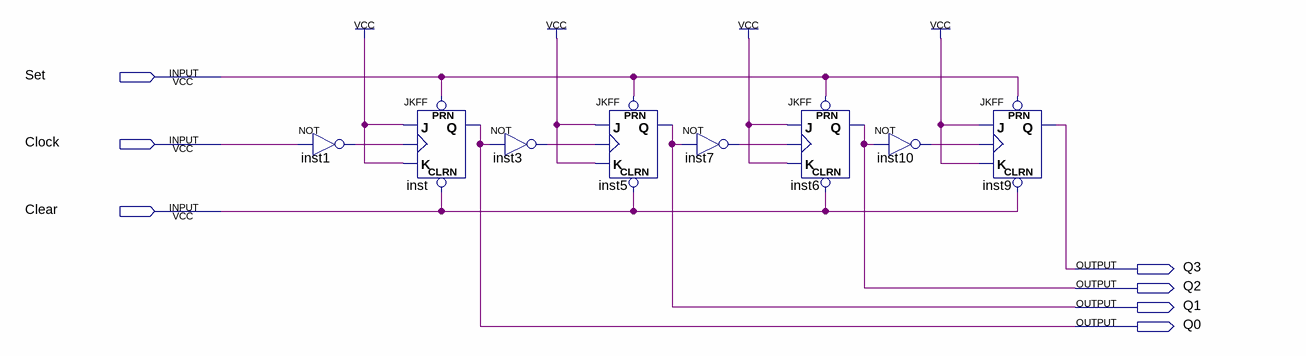
[diagram p0: schematic sheet]
// Quartus schematic Counter1.bdf as structural Verilog: 8 symbols, 7 pins
module Counter1 (
  input  Set,
  input  Clock,
  input  Clear,
  output Q3,
  output Q2,
  output Q1,
  output Q0
);

  wire inst1_out, inst3_out, inst7_out, inst10_out;

  not inst1 (inst1_out, Clock);
  JKFF inst (.PRN(Set), .CLRN(Clear), .K(1'b1), .J(1'b1), .CLK(inst1_out), .Q(Q0));
  not inst3 (inst3_out, Q0);
  JKFF inst5 (.PRN(Set), .CLRN(Clear), .K(1'b1), .J(1'b1), .CLK(inst3_out), .Q(Q1));
  not inst7 (inst7_out, Q1);
  JKFF inst6 (.PRN(Set), .CLRN(Clear), .K(1'b1), .J(1'b1), .CLK(inst7_out), .Q(Q2));
  not inst10 (inst10_out, Q2);
  JKFF inst9 (.PRN(Set), .CLRN(Clear), .K(1'b1), .J(1'b1), .CLK(inst10_out), .Q(Q3));
endmodule
